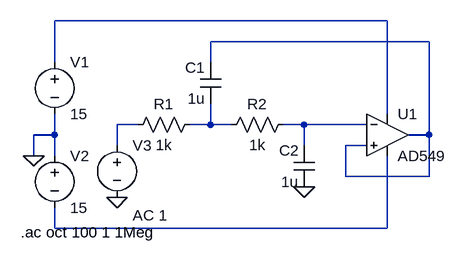
[diagram p0: schematic LowPassFilter2.asc]
LowPassFilter2.asc, the LTspice schematic file:
Version 4
SHEET 1 880 680
WIRE 432 32 -80 32
WIRE 496 64 160 64
WIRE -80 96 -80 32
WIRE 160 96 160 64
WIRE 432 176 432 32
WIRE 48 192 16 192
WIRE 160 192 160 160
WIRE 160 192 128 192
WIRE 192 192 160 192
WIRE 304 192 272 192
WIRE 400 192 304 192
WIRE -80 208 -80 176
WIRE -80 208 -112 208
WIRE 496 208 496 64
WIRE 496 208 464 208
WIRE 16 224 16 192
WIRE 304 224 304 192
WIRE 400 224 368 224
WIRE -112 240 -112 208
WIRE -80 240 -80 208
WIRE 368 272 368 224
WIRE 496 272 496 208
WIRE 496 272 368 272
WIRE -80 352 -80 320
WIRE 432 352 432 240
WIRE 432 352 -80 352
FLAG -112 240 0
FLAG 16 304 0
FLAG 304 288 0
SYMBOL voltage -80 80 R0
WINDOW 123 0 0 Left 0
WINDOW 39 0 0 Left 0
SYMATTR InstName V1
SYMATTR Value 15
SYMBOL voltage -80 224 R0
WINDOW 123 0 0 Left 0
WINDOW 39 0 0 Left 0
SYMATTR InstName V2
SYMATTR Value 15
SYMBOL voltage 16 208 R0
WINDOW 123 24 124 Left 2
WINDOW 39 0 0 Left 0
SYMATTR InstName V3
SYMATTR Value ""
SYMATTR Value2 AC 1
SYMBOL Opamps\\AD549 432 144 R0
SYMATTR InstName U1
SYMBOL res 144 176 R90
WINDOW 0 0 56 VBottom 2
WINDOW 3 32 56 VTop 2
SYMATTR InstName R1
SYMATTR Value 1k
SYMBOL res 288 176 R90
WINDOW 0 0 56 VBottom 2
WINDOW 3 32 56 VTop 2
SYMATTR InstName R2
SYMATTR Value 1k
SYMBOL cap 176 160 R180
WINDOW 0 24 56 Left 2
WINDOW 3 24 8 Left 2
SYMATTR InstName C1
SYMATTR Value 1u
SYMBOL cap 320 288 R180
WINDOW 0 24 56 Left 2
WINDOW 3 24 8 Left 2
SYMATTR InstName C2
SYMATTR Value 1u
TEXT -132 358 Left 2 !.ac oct 100 1 1Meg

The netlist it stands for:
* LowPassFilter2.asc
V1 N001 0 15
V2 0 N006 15
V3 N003 0 AC 1
XU1 N002 N005 N001 N006 N002 AD549  ; pins In+ In- V+ V- OUT
R1 N004 N003 1k
R2 N005 N004 1k
C1 N004 N002 1u
C2 0 N005 1u
.ac oct 100 1 1Meg
.backanno
.end